# Altium schematic sheet SCREEN+SWITCH.SchDoc
size A4; SheetNumber: 5; SheetTotal: 6
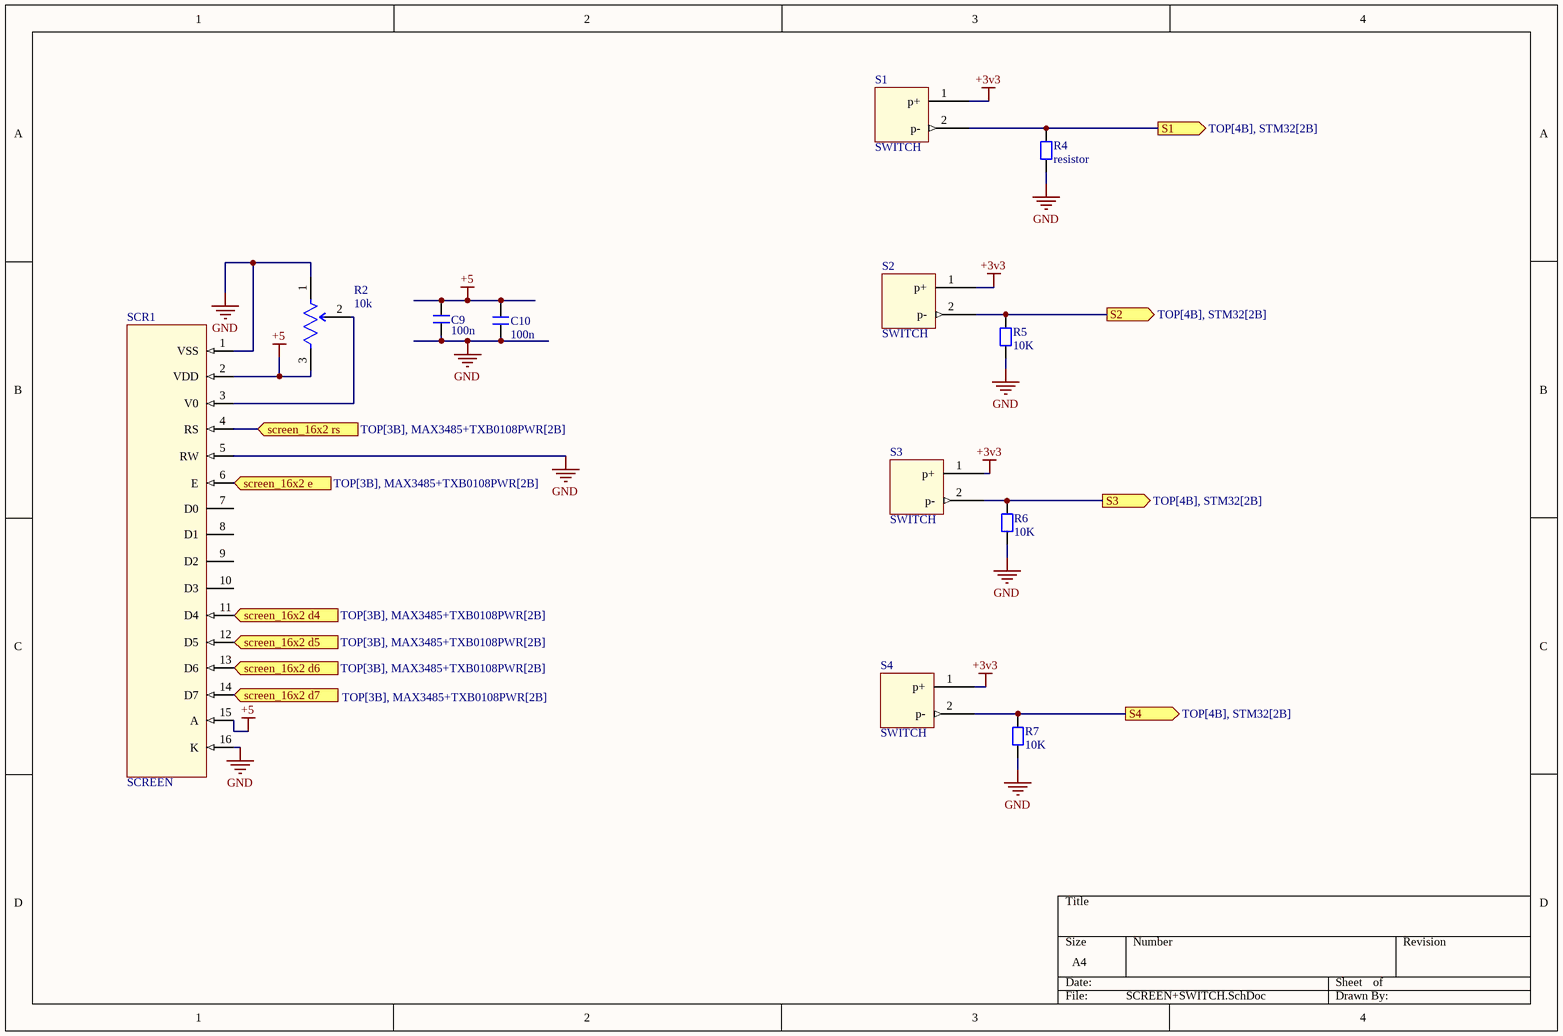
[diagram p0: SCREEN+SWITCH.SchDoc]

## Parts
C9  100n  [0805]
C10  100n  [0805]
R2  10k  [potentiometer]
R4  resistor  [0805]
R5  10K  [0805]
R6  10K  [0805]
R7  10K  [0805]
S1  SWITCH  [SWITCh]
S2  SWITCH  [SWITCh]
S3  SWITCH  [SWITCh]
S4  SWITCH  [SWITCh]
SCR1  SCREEN  [SCREEN]

## Ports
S1 (out, see TOP[4B], STM32[2B]), S2 (out, see TOP[4B], STM32[2B]), S3 (out, see TOP[4B], STM32[2B]), S4 (out, see TOP[4B], STM32[2B]), screen_16x2 d4 (in, see TOP[3B], MAX3485+TXB0108PWR[2B]), screen_16x2 d5 (in, see TOP[3B], MAX3485+TXB0108PWR[2B]), screen_16x2 d6 (in, see TOP[3B], MAX3485+TXB0108PWR[2B]), screen_16x2 d7 (in, see TOP[3B], MAX3485+TXB0108PWR[2B]), screen_16x2 e (in, see TOP[3B], MAX3485+TXB0108PWR[2B]), screen_16x2 rs (in, see TOP[3B], MAX3485+TXB0108PWR[2B])

## Nets
+3v3: S1.1(p+) S2.1(p+) S3.1(p+) S4.1(p+)
+5: C9.1 C10.1 R2.3(CW) SCR1.2(VDD) SCR1.15(A)
GND: C9.2 C10.2 R2.1(CCW) R4.2 R5.2 R6.2 R7.2 SCR1.1(VSS) SCR1.5(RW) SCR1.16(K)
S1: R4.1 S1.2(p-) ; port S1
S2: R5.1 S2.2(p-) ; port S2
S3: R6.1 S3.2(p-) ; port S3
S4: R7.1 S4.2(p-) ; port S4
screen_16x2 d4: SCR1.11(D4) ; port screen_16x2 d4
screen_16x2 d5: SCR1.12(D5) ; port screen_16x2 d5
screen_16x2 d6: SCR1.13(D6) ; port screen_16x2 d6
screen_16x2 d7: SCR1.14(D7) ; port screen_16x2 d7
screen_16x2 e: SCR1.6(E) ; port screen_16x2 e
screen_16x2 rs: SCR1.4(RS) ; port screen_16x2 rs
NetR2_2: R2.2(WIPER) SCR1.3(V0)

Not connected (* = marked no-connect by the designer): SCR1 7(D0) 8(D1) 9(D2) 10(D3)

## Library data of the parts
C9 C10 = capacitor
R2 = potentiometer
R5-R7 = resistor